# Altium schematic sheet NIXIE.SchDoc
size A4; SheetNumber: 2; SheetTotal: 2
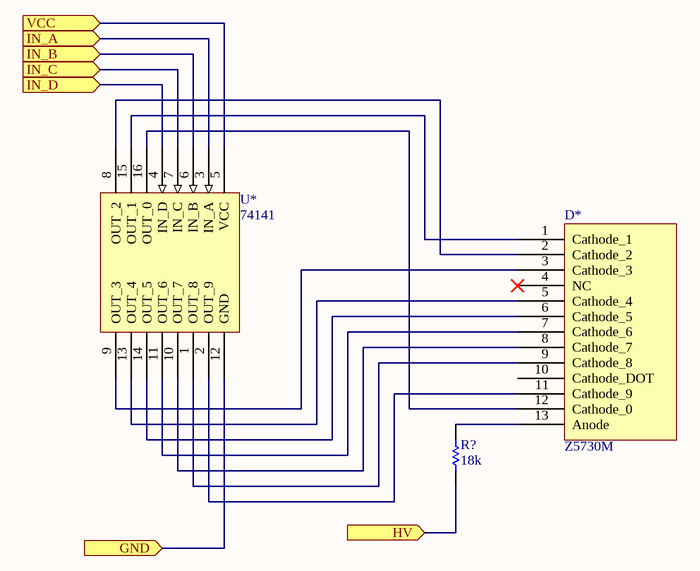
[diagram p0: NIXIE.SchDoc]

## Parts
D*  Z5730M  [Z5730M]
R?  18k  [RESC2013X60X40LL20T25]
U*  74141  [DIP-16]

## Ports
GND (in), HV (in), IN_A (in), IN_B (in), IN_C (in), IN_D (in), VCC (in)

## Nets
GND: U*.12(GND) ; port GND
HV: R?.1 ; port HV
IN_A: U*.3(IN_A) ; port IN_A
IN_B: U*.6(IN_B) ; port IN_B
IN_C: U*.7(IN_C) ; port IN_C
IN_D: U*.4(IN_D) ; port IN_D
VCC: U*.5(VCC) ; port VCC
NetD*_1: D*.1(Cathode_1) U*.15(OUT_1)
NetD*_2: D*.2(Cathode_2) U*.8(OUT_2)
NetD*_3: D*.3(Cathode_3) U*.9(OUT_3)
NetD*_5: D*.5(Cathode_4) U*.13(OUT_4)
NetD*_6: D*.6(Cathode_5) U*.14(OUT_5)
NetD*_7: D*.7(Cathode_6) U*.11(OUT_6)
NetD*_8: D*.8(Cathode_7) U*.10(OUT_7)
NetD*_9: D*.9(Cathode_8) U*.1(OUT_8)
NetD*_11: D*.11(Cathode_9) U*.2(OUT_9)
NetD*_12: D*.12(Cathode_0) U*.16(OUT_0)
NetD*_13: D*.13(Anode) R?.2

Not connected (* = marked no-connect by the designer): D* 4(NC)* 10(Cathode_DOT)

## Library data of the parts
R? = CMP-2001-00606-1: Manufacturer: Panasonic; Part Number: ERA6AEB183V